# Altium schematic sheet TMC_CARD.SchDoc
size A4
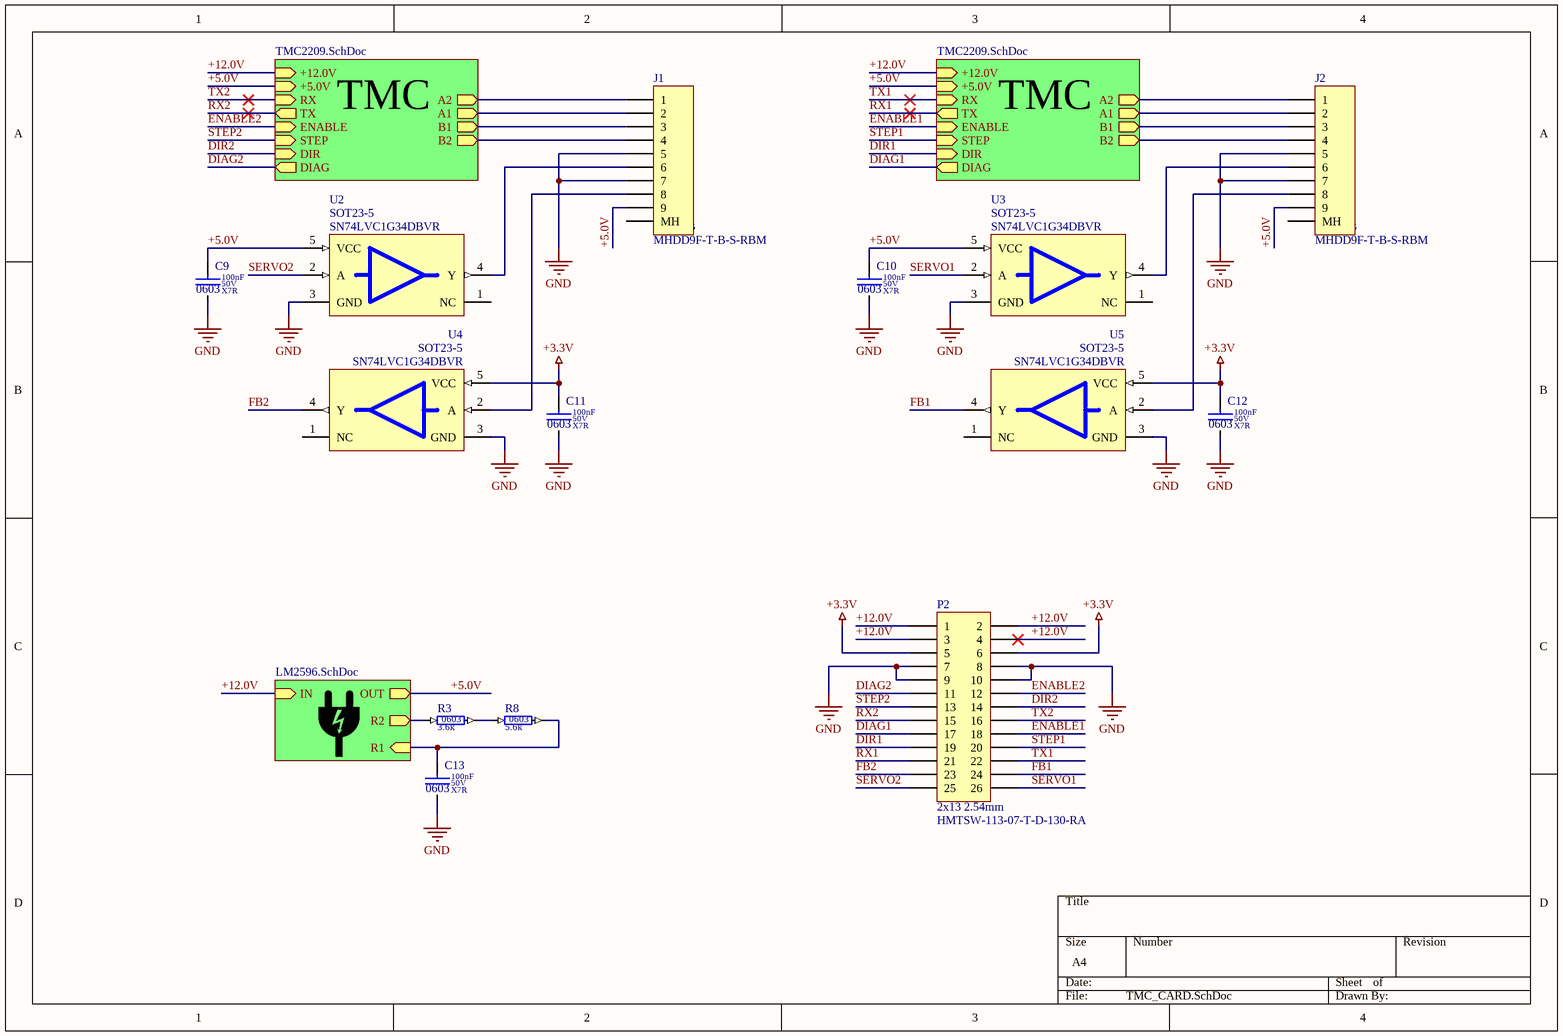
[diagram p0: TMC_CARD.SchDoc]

## Parts
C9  value 100nF  Dielectric: X7R  Voltage: 50V  SCH_Footprint: 0603  [C_0603_1608]  (hidden comment: Ceramic X7R)
C10  value 100nF  Dielectric: X7R  Voltage: 50V  SCH_Footprint: 0603  [C_0603_1608]  (hidden comment: Ceramic X7R)
C11  value 100nF  Dielectric: X7R  Voltage: 50V  SCH_Footprint: 0603  [C_0603_1608]  (hidden comment: Ceramic X7R)
C12  value 100nF  Dielectric: X7R  Voltage: 50V  SCH_Footprint: 0603  [C_0603_1608]  (hidden comment: Ceramic X7R)
C13  value 100nF  Dielectric: X7R  Voltage: 50V  SCH_Footprint: 0603  [C_0603_1608]  (hidden comment: Ceramic X7R)
J1  value MHDD9F-T-B-S-RBM  [J_DSUB_MHDD9F-T-B-S-RBM]  (hidden comment: DSUB 9 Pin)
J2  value MHDD9F-T-B-S-RBM  [J_DSUB_MHDD9F-T-B-S-RBM]  (hidden comment: DSUB 9 Pin)
P2  value HMTSW-113-07-T-D-130-RA  SCH_Footprint: 2x13 2.54mm  [P_HEADER_2x13_2.54_RIGHT_ANGLE]  (hidden comment: Goldpin male)
R3  value 3.6k  SCH_Footprint: 0603  [R_0603_1608]  (hidden comment: Resistor)
R8  value 5.6k  SCH_Footprint: 0603  [R_0603_1608]  (hidden comment: Resistor)
U2  value SN74LVC1G34DBVR  SCH_Footprint: SOT23-5  [SOT23-5_SC74A_SOT753_M]  (hidden comment: Single Buffer Gate)
U3  value SN74LVC1G34DBVR  SCH_Footprint: SOT23-5  [SOT23-5_SC74A_SOT753_M]  (hidden comment: Single Buffer Gate)
U4  value SN74LVC1G34DBVR  SCH_Footprint: SOT23-5  [SOT23-5_SC74A_SOT753_M]  (hidden comment: Single Buffer Gate)
U5  value SN74LVC1G34DBVR  SCH_Footprint: SOT23-5  [SOT23-5_SC74A_SOT753_M]  (hidden comment: Single Buffer Gate)

## Sub-sheets
Designator = TMC2209.SchDoc: TX (out), +5.0V (in), RX (in), DIR (in), STEP (in), +12.0V (in), DIAG (out), ENABLE (in), A1 (out), A2 (out), B2 (out), B1 (out)
Designator = LM2596.SchDoc: IN (in), R1 (in), R2 (out), OUT (out)
Designator = TMC2209.SchDoc: TX (out), +5.0V (in), RX (in), DIR (in), STEP (in), +12.0V (in), DIAG (out), ENABLE (in), A1 (out), A2 (out), B2 (out), B1 (out)

## Nets
+3.3V: C11.1 C12.1 P2.5 P2.6 U4.5(VCC) U5.5(VCC)
GND: C9.2 C10.2 C11.2 C12.2 C13.2 J1.5 J1.7 J2.5 J2.7 P2.7 P2.8 P2.9 P2.10 U2.3(GND) U3.3(GND) U4.3(GND) U5.3(GND)
+5.0V: C9.1 C10.1 J1.9 J2.9 U2.5(VCC) U3.5(VCC) ; sheet Designator/+5.0V, sheet Designator/OUT, sheet Designator/+5.0V
+12.0V: P2.1 P2.2 P2.3 P2.4 ; sheet Designator/+12.0V, sheet Designator/IN, sheet Designator/+12.0V
DIAG1: P2.17 ; sheet Designator/DIAG
DIAG2: P2.11 ; sheet Designator/DIAG
DIR1: P2.19 ; sheet Designator/DIR
DIR2: P2.14 ; sheet Designator/DIR
ENABLE1: P2.18 ; sheet Designator/ENABLE
ENABLE2: P2.12 ; sheet Designator/ENABLE
FB1: P2.24 U5.4(Y)
FB2: P2.23 U4.4(Y)
RX1: P2.21 ; sheet Designator/TX
RX2: P2.15 ; sheet Designator/TX
SERVO1: P2.26 U3.2(A)
SERVO2: P2.25 U2.2(A)
STEP1: P2.20 ; sheet Designator/STEP
STEP2: P2.13 ; sheet Designator/STEP
TX1: P2.22 ; sheet Designator/RX
TX2: P2.16 ; sheet Designator/RX
NetC13_1: C13.1 R8.2 ; sheet Designator/R1
NetJ1_1: J1.1 ; sheet Designator/A2
NetJ1_2: J1.2 ; sheet Designator/A1
NetJ1_3: J1.3 ; sheet Designator/B1
NetJ1_4: J1.4 ; sheet Designator/B2
NetJ1_6: J1.6 U2.4(Y)
NetJ1_8: J1.8 U4.2(A)
NetJ2_1: J2.1 ; sheet Designator/A2
NetJ2_2: J2.2 ; sheet Designator/A1
NetJ2_3: J2.3 ; sheet Designator/B1
NetJ2_4: J2.4 ; sheet Designator/B2
NetJ2_6: J2.6 U3.4(Y)
NetJ2_8: J2.8 U5.2(A)
NetR3_1: R3.1 ; sheet Designator/R2
NetR3_2: R3.2 R8.1

Not connected (* = marked no-connect by the designer): J1 MH; J2 MH; U2 1(NC); U3 1(NC); U4 1(NC); U5 1(NC)

## Notes on the sheet
- TMC

## Library data of the parts
C9-C13 = C_100nF_50V_X7R_0603_5: Capacitor; Manufacturer: Samsung; Manufacturer Part Number: CL10B104JB8NNNC; Tolerance (%): 5; Part Number: C_100nF_50V_X7R_0603_5; HelpURL: http://www.tme.eu/pl/Document/4a42202b32dab16128fe107dd69598cc/samsung-chip-cap.pdf; Supplier 1: TME; Supplier Part Number 1: CL10B104JB8NNNC; Supplier 2: RS Components; Supplier Part Number 2: 7665455; Supplier 3: Farnell; Supplier 4: Mouser; Supplier 5: Digi-Key; Supplier Part Number 5: 1276-1033-1-ND; Supplier 6: LCSC; Supplier Part Number 6: C24452
J1 J2 = J_DSUB: Header, 9-Pin; Manufacturer: MH Connectors; SCH_Footprint: J_DSUB; Part Number: J_DSUB; HelpURL: https://www.tme.eu/Document/d24efe21bdaa08410b5ca50a678e1de1/MHDDXX-F-T-B-S-RBM.PDF; Manufacturer Part Number: MHDD9F-T-B-S-RBM; Supplier 1: TME; Supplier Part Number 1: MHDD9F-T-B-S-RBM; Supplier 2: RS Components; Supplier 3: Farnell; Supplier Part Number 3: 2533067; Supplier 4: Mouser; Supplier 5: Digi-Key; Supplier 6: LCSC
P2 = P_HEADER_2x13_2.54_ANGLE: Pin Header; Manufacturer: Samtec; Part Number: P_HEADER_2x13_2.54_ANGLE; HelpURL: https://datasheet.octopart.com/HMTSW-113-07-T-D-130-RA-Samtec-datasheet-97080704.pdf; Manufacturer Part Number: HMTSW-113-07-T-D-130-RA; Supplier 1: TME; Supplier 2: RS Components; Supplier 3: Farnell; Supplier 4: Mouser; Supplier Part Number 4: 200-HMTSW1137TD130RA; Supplier 5: Digi-Key; Supplier Part Number 5: HMTSW-113-07-T-D-130-RA-ND; Supplier 6: LCSC
R3 = R_3.6k_0603_1: Manufacturer: Royalohm; Manufacturer Part Number: 0603SAF3601T5E; Voltage: 50V; Power: 100mW; Tolerance: 1%; Part Number: R_3.6k_0603_1; HelpURL: http://www.tme.eu/pl/Document/9e42ba54d36a9bd3dfa2901986ac022d/rezystor-smd.pdf; Supplier 1: TME; Supplier Part Number 1: SMD0603-3K6-1%; Supplier 2: RS Components; Supplier 3: Farnell; Supplier 4: Mouser; Supplier 5: Digi-Key; Supplier 6: LCSC
R8 = R_5.6k_0603_1: Manufacturer: Panasonic; Manufacturer Part Number: ERJ-P03F5601V; Voltage: 150V; Power: 200mW; Tolerance: 1%; Part Number: R_5.6k_0603_1; HelpURL: http://www.farnell.com/datasheets/2254497.pdf?_ga=2.43877285.1484910855.1540115356-953128292.1508669538&_gac=1.120258938.1537431950.CjwKCAjwio3dBRAqEiwAHWsNVZEMh9W8beiEu-RVCZge823z2VsFxW0tiik5tVH4kBGBJX-1pEyq7RoCMTgQAvD_BwE; Supplier 1: TME; Supplier 2: RS Components; Supplier Part Number 2: 721-7400; Supplier 3: Farnell; Supplier Part Number 3: 1750682; Supplier 4: Mouser; Supplier Part Number 4: 667-ERJ-P03F5601V; Supplier 5: Digi-Key; Supplier Part Number 5: ERJ-P03F5601V-ND; Supplier 6: LCSC
U2-U5 = U_SN74LVC1G34DBVR: Manufacturer: Texas Instruments; Part Number: U_SN74LVC1G34DBVR; HelpURL: http://www.ti.com/lit/ds/symlink/sn74lvc1g34.pdf; Manufacturer Part Number: SN74LVC1G34DBVR; Supplier 1: TME; Supplier Part Number 1: SN74LVC1G34DBVR; Supplier 2: RS Components; Supplier Part Number 2: 662-8774; Supplier 3: Farnell; Supplier Part Number 3: 2134094; Supplier 4: Mouser; Supplier Part Number 4: 595-SN74LVC1G34DBVR; Supplier 5: Digi-Key; Supplier Part Number 5: 296-17893-1-ND; Supplier 6: LCSC